# EasyEDA Pro project 学期项目.epro, schematic Sheet1
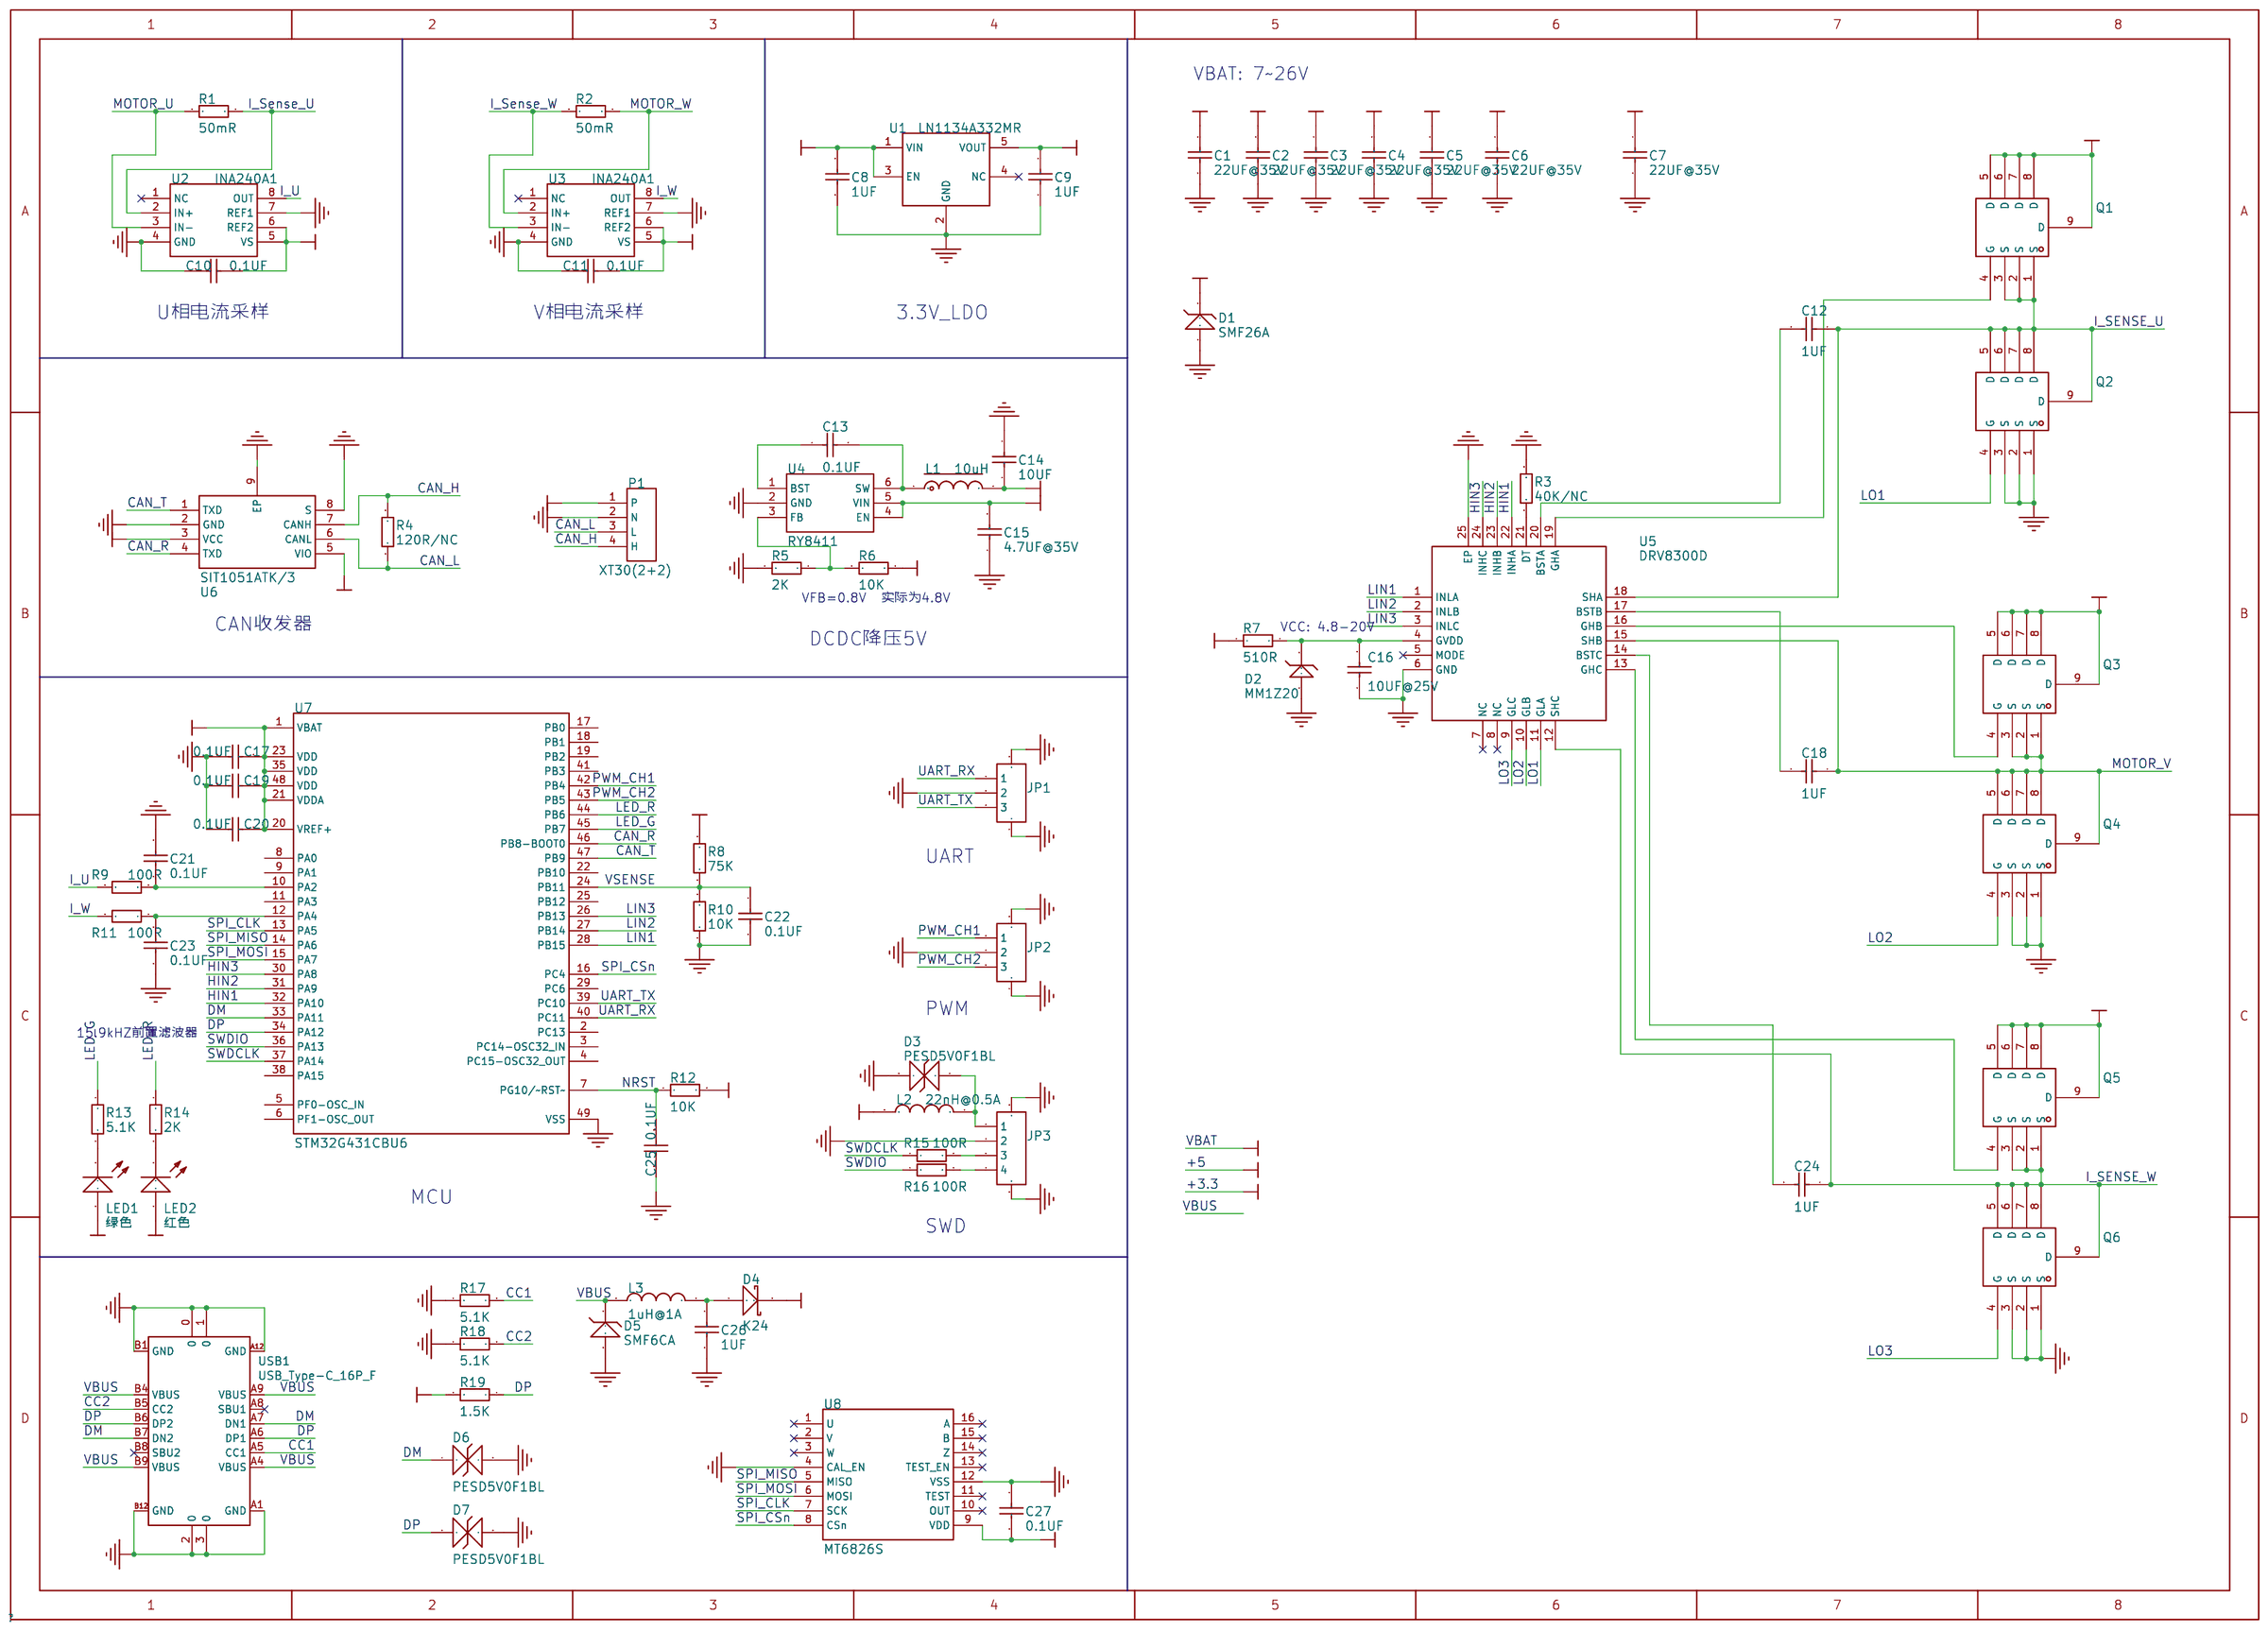
[diagram p5: schematic sheet]

## Parts
C1  22UF@35V  [C1206_NS]
C2  22UF@35V  [C1206_NS]
C3  22UF@35V  [C1206_NS]
C4  22UF@35V  [C1206_NS]
C5  22UF@35V  [C1206_NS]
C6  22UF@35V  [C1206_NS]
C7  22UF@35V  [C1206_NS]
C8  1UF  [C0402_NS]
C9  1UF  [C0402_NS]
C10  0.1UF  [C0402_NS]
C11  0.1UF  [C0402_NS]
C12  1UF  [C0603_NS]
C13  0.1UF  [C0402_NS]
C14  10UF  [C0805_NS]
C15  4.7UF@35V  [C0805_NS]
C16  10UF@25V  [C0603_NS]
C17  0.1UF  [C0402_NS]
C18  1UF  [C0603_NS]
C19  0.1UF  [C0402_NS]
C20  0.1UF  [C0402_NS]
C21  0.1UF  [C0402_NS]
C22  0.1UF  [C0402_NS]
C23  0.1UF  [C0402_NS]
C24  1UF  [C0603_NS]
C25  0.1UF  [C0402_NS]
C26  1UF  [C0603_NS]
C27  0.1UF  [C0402_NS]
D1  SMF26A  [SOD-123]
D2  MM1Z20  [SOD-123]
D3  PESD5V0F1BL  [DFN1006-2L_L1.0_W0.6_P0.7]
D4  K24  [SOD-123]
D5  SMF6CA  [SOD-123]
D6  PESD5V0F1BL  [DFN1006-2L_L1.0_W0.6_P0.7]
D7  PESD5V0F1BL  [DFN1006-2L_L1.0_W0.6_P0.7]
JP1  CON-3P  [SH1.0-WT-3P]
JP2  CON-3P  [SH1.0-WT-3P]
JP3  CON-4P  [HC0.8-WT-4P]
L1  10uH  [NR3015]
L2  22nH@0.5A  [L0402_NS]
L3  1uH@1A  [L1206_NS]
LED1  绿色  [LED0402_NS]
LED2  红色  [LED0402_NS]
P1  XT30(2+2)  [XT30(2+2)PW-M]
Q1  AON7544  [DFN8_L3.3_W3.3_P0.65]
Q2  AON7544  [DFN8_L3.3_W3.3_P0.65]
Q3  AON7544  [DFN8_L3.3_W3.3_P0.65]
Q4  AON7544  [DFN8_L3.3_W3.3_P0.65]
Q5  AON7544  [DFN8_L3.3_W3.3_P0.65]
Q6  AON7544  [DFN8_L3.3_W3.3_P0.65]
R1  50mR  [R1206_NS]
R2  50mR  [R1206_NS]
R3  40K/NC  [R0402_NS]
R4  120R/NC  [R0603_NS]
R5  2K  [R0402_NS]
R6  10K  [R0402_NS]
R7  510R  [R0603_NS]
R8  75K  [R0402_NS]
R9  100R  [R0402_NS]
R10  10K  [R0402_NS]
R11  100R  [R0402_NS]
R12  10K  [R0402_NS]
R13  5.1K  [R0402_NS]
R14  2K  [R0402_NS]
R15  100R  [R0402_NS]
R16  100R  [R0402_NS]
R17  5.1K  [R0402_NS]
R18  5.1K  [R0402_NS]
R19  1.5K  [R0402_NS]
U1  LN1134A332MR  [SOT23-5_L3.0_W1.7_P0.95]
U2  INA240A1  [TSSOP8_L4.4_W3.0_P0.65]
U3  INA240A1  [TSSOP8_L4.4_W3.0_P0.65]
U4  RY8411  [SOT23-6_L3.0_W1.7_P0.95]
U5  DRV8300D  [QFN24_L4.0_W4.0_P0.5]
U6  SIT1051ATK/3  [DFN8_L3.0_W3.0_P0.65]
U7  STM32G431CBU6  [QFN48_L7.0_W7.0_P0.5]
U8  MT6826S  [TSSOP16_L5.0_W4.4_P0.65]
USB1  USB_Type-C_16P_F  [USB_Type-C_SMD_16P_F]

## Library data of the parts
C1-C7 = 22UF@35V: 贴片电容/MLCC电容; BOM名称: MLCC; OriginFootprint 2: C0402_L; OriginFootprint 3: C0603_L; OriginFootprint 4: C0805_L; OriginFootprint 5: C1206_L; OriginFootprint 6: C1210_L; OriginFootprint 7: C1808_L; OriginFootprint 8: C1825_L; OriginFootprint 9: C2225_L; OriginFootprint 10: C0201_M; OriginFootprint 11: C0402_M; OriginFootprint 12: C0603_M; OriginFootprint 13: C0805_M; OriginFootprint 14: C1206_M; OriginFootprint 15: C1210_M; OriginFootprint 16: C1808_M; OriginFootprint 17: C1825_M; OriginFootprint 18: C2225_M; OriginFootprint 19: C0201_NS; OriginFootprint 20: C0402_NS; OriginFootprint 21: C01005_NS; OriginFootprint 22: C0805_NS; OriginFootprint 23: C1210_NS; OriginFootprint 24: C0603_NS; DesignItemID: C; LibraryName: 阻容
C8 C9 = 1UF_1: 贴片电容/MLCC电容; BOM名称: MLCC; OriginFootprint 2: C0402_L; OriginFootprint 3: C0603_L; OriginFootprint 4: C0805_L; OriginFootprint 5: C1206_L; OriginFootprint 6: C1210_L; OriginFootprint 7: C1808_L; OriginFootprint 8: C1825_L; OriginFootprint 9: C2225_L; OriginFootprint 10: C0201_M; OriginFootprint 11: C0402_M; OriginFootprint 12: C0603_M; OriginFootprint 13: C0805_M; OriginFootprint 14: C1206_M; OriginFootprint 15: C1210_M; OriginFootprint 16: C1808_M; OriginFootprint 17: C1825_M; OriginFootprint 18: C2225_M; OriginFootprint 19: C0201_NS; OriginFootprint 20: C01005_NS; OriginFootprint 21: C0805_NS; OriginFootprint 22: C1206_NS; OriginFootprint 23: C1210_NS; OriginFootprint 24: C0603_NS; DesignItemID: C; LibraryName: 阻容
C10 C11 C13 C17 C19-C23 C25 C27 = 0.1UF: 贴片电容/MLCC电容; BOM名称: MLCC; OriginFootprint 2: C0402_L; OriginFootprint 3: C0603_L; OriginFootprint 4: C0805_L; OriginFootprint 5: C1206_L; OriginFootprint 6: C1210_L; OriginFootprint 7: C1808_L; OriginFootprint 8: C1825_L; OriginFootprint 9: C2225_L; OriginFootprint 10: C0201_M; OriginFootprint 11: C0402_M; OriginFootprint 12: C0603_M; OriginFootprint 13: C0805_M; OriginFootprint 14: C1206_M; OriginFootprint 15: C1210_M; OriginFootprint 16: C1808_M; OriginFootprint 17: C1825_M; OriginFootprint 18: C2225_M; OriginFootprint 19: C0201_NS; OriginFootprint 20: C01005_NS; OriginFootprint 21: C0805_NS; OriginFootprint 22: C1206_NS; OriginFootprint 23: C1210_NS; OriginFootprint 24: C0603_NS; DesignItemID: C; LibraryName: 阻容
C12 C18 C24 C26 = 1UF: 贴片电容/MLCC电容; BOM名称: MLCC; OriginFootprint 2: C0402_L; OriginFootprint 3: C0603_L; OriginFootprint 4: C0805_L; OriginFootprint 5: C1206_L; OriginFootprint 6: C1210_L; OriginFootprint 7: C1808_L; OriginFootprint 8: C1825_L; OriginFootprint 9: C2225_L; OriginFootprint 10: C0201_M; OriginFootprint 11: C0402_M; OriginFootprint 12: C0603_M; OriginFootprint 13: C0805_M; OriginFootprint 14: C1206_M; OriginFootprint 15: C1210_M; OriginFootprint 16: C1808_M; OriginFootprint 17: C1825_M; OriginFootprint 18: C2225_M; OriginFootprint 19: C0201_NS; OriginFootprint 20: C0402_NS; OriginFootprint 21: C01005_NS; OriginFootprint 22: C0805_NS; OriginFootprint 23: C1206_NS; OriginFootprint 24: C1210_NS; DesignItemID: C; LibraryName: 阻容
C14 = 10UF: 贴片电容/MLCC电容; BOM名称: MLCC; OriginFootprint 2: C0402_L; OriginFootprint 3: C0603_L; OriginFootprint 4: C0805_L; OriginFootprint 5: C1206_L; OriginFootprint 6: C1210_L; OriginFootprint 7: C1808_L; OriginFootprint 8: C1825_L; OriginFootprint 9: C2225_L; OriginFootprint 10: C0201_M; OriginFootprint 11: C0402_M; OriginFootprint 12: C0603_M; OriginFootprint 13: C0805_M; OriginFootprint 14: C1206_M; OriginFootprint 15: C1210_M; OriginFootprint 16: C1808_M; OriginFootprint 17: C1825_M; OriginFootprint 18: C2225_M; OriginFootprint 19: C0201_NS; OriginFootprint 20: C0402_NS; OriginFootprint 21: C01005_NS; OriginFootprint 22: C1206_NS; OriginFootprint 23: C1210_NS; OriginFootprint 24: C0603_NS; DesignItemID: C; LibraryName: 阻容
C15 = 4.7UF@35V: 贴片电容/MLCC电容; BOM名称: MLCC; OriginFootprint 2: C0402_L; OriginFootprint 3: C0603_L; OriginFootprint 4: C0805_L; OriginFootprint 5: C1206_L; OriginFootprint 6: C1210_L; OriginFootprint 7: C1808_L; OriginFootprint 8: C1825_L; OriginFootprint 9: C2225_L; OriginFootprint 10: C0201_M; OriginFootprint 11: C0402_M; OriginFootprint 12: C0603_M; OriginFootprint 13: C0805_M; OriginFootprint 14: C1206_M; OriginFootprint 15: C1210_M; OriginFootprint 16: C1808_M; OriginFootprint 17: C1825_M; OriginFootprint 18: C2225_M; OriginFootprint 19: C0201_NS; OriginFootprint 20: C0402_NS; OriginFootprint 21: C01005_NS; OriginFootprint 22: C1206_NS; OriginFootprint 23: C1210_NS; OriginFootprint 24: C0603_NS; DesignItemID: C; LibraryName: 阻容
C16 = 10UF@25V: 贴片电容/MLCC电容; BOM名称: MLCC; OriginFootprint 2: C0402_L; OriginFootprint 3: C0603_L; OriginFootprint 4: C0805_L; OriginFootprint 5: C1206_L; OriginFootprint 6: C1210_L; OriginFootprint 7: C1808_L; OriginFootprint 8: C1825_L; OriginFootprint 9: C2225_L; OriginFootprint 10: C0201_M; OriginFootprint 11: C0402_M; OriginFootprint 12: C0603_M; OriginFootprint 13: C0805_M; OriginFootprint 14: C1206_M; OriginFootprint 15: C1210_M; OriginFootprint 16: C1808_M; OriginFootprint 17: C1825_M; OriginFootprint 18: C2225_M; OriginFootprint 19: C0201_NS; OriginFootprint 20: C0402_NS; OriginFootprint 21: C01005_NS; OriginFootprint 22: C0805_NS; OriginFootprint 23: C1206_NS; OriginFootprint 24: C1210_NS; DesignItemID: C; LibraryName: 阻容
D1 = SMF26A: TVS通用; BOM名称: TVS; OriginFootprint 2: SMB; OriginFootprint 3: SOD-123F; DesignItemID: TVS; LibraryName: 二极管(含LED)
D2 = MM1Z20: 稳压二极管; BOM名称: 稳压二极管; Power Dissipation (Pd): 500mW; Voltage: 5.1V; DesignItemID: MM1ZXX; LibraryName: 二极管(含LED)
D3 D6 D7 = PESD5V0F1BL: 双向静电和浪涌保护(TVS/ESD); LibraryName: 二极管(含LED)
D4 = K24: 肖特基二极管; BOM名称: 肖特基二极管; 属性: 个位*10V/十位A; OriginFootprint 2: SMB; OriginFootprint 3: SMC; OriginFootprint 4: SOD-323; OriginFootprint 5: SOD-523; DesignItemID: SSXX; LibraryName: 二极管(含LED)
D5 = SMF6CA: TVS通用; BOM名称: TVS; OriginFootprint 2: SMB; OriginFootprint 3: SOD-123F; DesignItemID: TVS; LibraryName: 二极管(含LED)
JP1 JP2 = CON-3P: 3P连接器; BOM名称: 3P连接器; DesignItemID: Header 3; LibraryName: 1.00mm连接器
JP3 = CON-4P: 4P连接器; BOM名称: 4P连接器; DesignItemID: Header 4; LibraryName: 0.80mm连接器
L1 = 10uH: 太诱-NR磁胶电感; BOM名称: NR磁胶电感; OriginFootprint 2: NR3010; OriginFootprint 3: NR3012; OriginFootprint 4: NR4010; OriginFootprint 5: NR4018; OriginFootprint 6: NR4020; OriginFootprint 7: NR4026; OriginFootprint 8: NR4030; OriginFootprint 9: NR5012; OriginFootprint 10: NR5020; OriginFootprint 11: NR5040; OriginFootprint 12: NR6020; OriginFootprint 13: NR6028; OriginFootprint 14: NR6045; OriginFootprint 15: NR8040; DesignItemID: L-NR; LibraryName: 电感
L2 = 22nH@0.5A: 小功率贴片电感; BOM名称: 小功率贴片电感; OriginFootprint 2: L0603; OriginFootprint 3: L0805; OriginFootprint 4: L1206; OriginFootprint 5: L1210; OriginFootprint 6: L1806; OriginFootprint 7: L1812; DesignItemID: L; LibraryName: 电感
L3 = 1uH@1A: 小功率贴片电感; BOM名称: 小功率贴片电感; OriginFootprint 2: L0603; OriginFootprint 3: L0805; OriginFootprint 4: L1206; OriginFootprint 5: L1210; OriginFootprint 6: L1806; OriginFootprint 7: L1812; OriginFootprint 8: L0402_NS; DesignItemID: L; LibraryName: 电感
LED1 = 绿色: 贴片LED; BOM名称: 贴片LED; OriginFootprint 2: LED0603_R; OriginFootprint 3: LED0603_B; OriginFootprint 4: LED0603_G; OriginFootprint 5: LED0603_Y; OriginFootprint 6: LED0805_G; OriginFootprint 7: LED0805_R; OriginFootprint 8: LED0805_B; OriginFootprint 9: LED0805_Y; OriginFootprint 10: LED 3528-2Pin; OriginFootprint 11: LED1206_G; OriginFootprint 12: LED 5730-V; OriginFootprint 13: LED1206_Y; OriginFootprint 14: LED0805_W; OriginFootprint 15: LED1206_B; OriginFootprint 16: LED1206_W; OriginFootprint 17: LED1206_R; OriginFootprint 18: LED0402_B; OriginFootprint 19: LED0402_G; OriginFootprint 20: LED0402_R; OriginFootprint 21: LED0402_W; OriginFootprint 22: LED0402_Y; DesignItemID: LED; LibraryName: 二极管(含LED)
LED2 = 红色: 贴片LED; BOM名称: 贴片LED; OriginFootprint 2: LED0603_R; OriginFootprint 3: LED0603_B; OriginFootprint 4: LED0603_G; OriginFootprint 5: LED0603_Y; OriginFootprint 6: LED0805_G; OriginFootprint 7: LED0805_R; OriginFootprint 8: LED0805_B; OriginFootprint 9: LED0805_Y; OriginFootprint 10: LED 3528-2Pin; OriginFootprint 11: LED1206_G; OriginFootprint 12: LED 5730-V; OriginFootprint 13: LED1206_Y; OriginFootprint 14: LED0805_W; OriginFootprint 15: LED1206_B; OriginFootprint 16: LED1206_W; OriginFootprint 17: LED1206_R; OriginFootprint 18: LED0402_B; OriginFootprint 19: LED0402_G; OriginFootprint 20: LED0402_R; OriginFootprint 21: LED0402_W; OriginFootprint 22: LED0402_Y; DesignItemID: LED; LibraryName: 二极管(含LED)
P1 = XT30(2+2): XT30(2+2)连接器; LibraryName: 接口
Q1-Q6 = AON7544: 类型:N沟道;漏源电压(Vdss):30V;连续漏极电流(Id):50A;导通电阻(RDS(on)Vgs,Id):5.7mΩ@10V,35A;阈值电压(Vgs(th)@Id):2.5V@250uA;; LCSC Part Name: N沟道 30V 50A; Supplier Footprint: DFN 3.3x3.3-8; Type: N沟道; Drain Source Voltage (Vdss): 30V; Continuous Drain Current (Id): 50A; Power Dissipation (Pd): 45W; Drain Source On Resistance (RDS(on)@Vgs,Id): 5.7mΩ@10V,35A; Gate Threshold Voltage (Vgs(th)@Id): 2.5V@250uA; DesignItemID: WSD3066DN33; LibraryName: 三极管-MOS管
R1 R2 = 50mR: 贴片电阻; BOM名称: 贴片电阻; OriginFootprint 2: R0402_L; OriginFootprint 3: R0603_L; OriginFootprint 4: R0805_L; OriginFootprint 5: R1206_L; OriginFootprint 6: R1210_L; OriginFootprint 7: R1812_L; OriginFootprint 8: R2010_L; OriginFootprint 9: R2512_L; OriginFootprint 10: R0201_M; OriginFootprint 11: R0402_M; OriginFootprint 12: R0603_M; OriginFootprint 13: R0805_M; OriginFootprint 14: R1206_M; OriginFootprint 15: R1210_M; OriginFootprint 16: R1812_M; OriginFootprint 17: R2010_M; OriginFootprint 18: R2512_M; OriginFootprint 19: R0201_NS; OriginFootprint 20: R0402_NS; OriginFootprint 21: R01005_NS; OriginFootprint 22: R0603_NS; OriginFootprint 23: R0805_NS; OriginFootprint 24: R1210_NS; DesignItemID: R; LibraryName: 阻容
R3 = 40K/NC: 贴片电阻; BOM名称: 贴片电阻; OriginFootprint 2: R0402_L; OriginFootprint 3: R0603_L; OriginFootprint 4: R0805_L; OriginFootprint 5: R1206_L; OriginFootprint 6: R1210_L; OriginFootprint 7: R1812_L; OriginFootprint 8: R2010_L; OriginFootprint 9: R2512_L; OriginFootprint 10: R0201_M; OriginFootprint 11: R0402_M; OriginFootprint 12: R0603_M; OriginFootprint 13: R0805_M; OriginFootprint 14: R1206_M; OriginFootprint 15: R1210_M; OriginFootprint 16: R1812_M; OriginFootprint 17: R2010_M; OriginFootprint 18: R2512_M; OriginFootprint 19: R0201_NS; OriginFootprint 20: R01005_NS; OriginFootprint 21: R0603_NS; OriginFootprint 22: R0805_NS; OriginFootprint 23: R1206_NS; OriginFootprint 24: R1210_NS; OriginFootprint 25: R2512_NS; DesignItemID: R; LibraryName: 阻容
R4 = 120R/NC: 贴片电阻; BOM名称: 贴片电阻; OriginFootprint 2: R0402_L; OriginFootprint 3: R0603_L; OriginFootprint 4: R0805_L; OriginFootprint 5: R1206_L; OriginFootprint 6: R1210_L; OriginFootprint 7: R1812_L; OriginFootprint 8: R2010_L; OriginFootprint 9: R2512_L; OriginFootprint 10: R0201_M; OriginFootprint 11: R0402_M; OriginFootprint 12: R0603_M; OriginFootprint 13: R0805_M; OriginFootprint 14: R1206_M; OriginFootprint 15: R1210_M; OriginFootprint 16: R1812_M; OriginFootprint 17: R2010_M; OriginFootprint 18: R2512_M; OriginFootprint 19: R0201_NS; OriginFootprint 20: R0402_NS; OriginFootprint 21: R01005_NS; OriginFootprint 22: R0805_NS; OriginFootprint 23: R1206_NS; OriginFootprint 24: R1210_NS; DesignItemID: R; LibraryName: 阻容
R5 R14 = 2K: 贴片电阻; BOM名称: 贴片电阻; OriginFootprint 2: R0402_L; OriginFootprint 3: R0603_L; OriginFootprint 4: R0805_L; OriginFootprint 5: R1206_L; OriginFootprint 6: R1210_L; OriginFootprint 7: R1812_L; OriginFootprint 8: R2010_L; OriginFootprint 9: R2512_L; OriginFootprint 10: R0201_M; OriginFootprint 11: R0402_M; OriginFootprint 12: R0603_M; OriginFootprint 13: R0805_M; OriginFootprint 14: R1206_M; OriginFootprint 15: R1210_M; OriginFootprint 16: R1812_M; OriginFootprint 17: R2010_M; OriginFootprint 18: R2512_M; OriginFootprint 19: R0201_NS; OriginFootprint 20: R01005_NS; OriginFootprint 21: R0603_NS; OriginFootprint 22: R0805_NS; OriginFootprint 23: R1206_NS; OriginFootprint 24: R1210_NS; DesignItemID: R; LibraryName: 阻容
R6 R12 = 10K: 贴片电阻; BOM名称: 贴片电阻; OriginFootprint 2: R0402_L; OriginFootprint 3: R0603_L; OriginFootprint 4: R0805_L; OriginFootprint 5: R1206_L; OriginFootprint 6: R1210_L; OriginFootprint 7: R1812_L; OriginFootprint 8: R2010_L; OriginFootprint 9: R2512_L; OriginFootprint 10: R0201_M; OriginFootprint 11: R0402_M; OriginFootprint 12: R0603_M; OriginFootprint 13: R0805_M; OriginFootprint 14: R1206_M; OriginFootprint 15: R1210_M; OriginFootprint 16: R1812_M; OriginFootprint 17: R2010_M; OriginFootprint 18: R2512_M; OriginFootprint 19: R0201_NS; OriginFootprint 20: R01005_NS; OriginFootprint 21: R0603_NS; OriginFootprint 22: R0805_NS; OriginFootprint 23: R1206_NS; OriginFootprint 24: R1210_NS; DesignItemID: R; LibraryName: 阻容
R7 = 510R: 贴片电阻; BOM名称: 贴片电阻; OriginFootprint 2: R0402_L; OriginFootprint 3: R0603_L; OriginFootprint 4: R0805_L; OriginFootprint 5: R1206_L; OriginFootprint 6: R1210_L; OriginFootprint 7: R1812_L; OriginFootprint 8: R2010_L; OriginFootprint 9: R2512_L; OriginFootprint 10: R0201_M; OriginFootprint 11: R0402_M; OriginFootprint 12: R0603_M; OriginFootprint 13: R0805_M; OriginFootprint 14: R1206_M; OriginFootprint 15: R1210_M; OriginFootprint 16: R1812_M; OriginFootprint 17: R2010_M; OriginFootprint 18: R2512_M; OriginFootprint 19: R0201_NS; OriginFootprint 20: R0402_NS; OriginFootprint 21: R01005_NS; OriginFootprint 22: R0805_NS; OriginFootprint 23: R1206_NS; OriginFootprint 24: R1210_NS; OriginFootprint 25: R2512_NS; DesignItemID: R; LibraryName: 阻容
R8 = 75K: 贴片电阻; BOM名称: 贴片电阻; OriginFootprint 2: R0402_L; OriginFootprint 3: R0603_L; OriginFootprint 4: R0805_L; OriginFootprint 5: R1206_L; OriginFootprint 6: R1210_L; OriginFootprint 7: R1812_L; OriginFootprint 8: R2010_L; OriginFootprint 9: R2512_L; OriginFootprint 10: R0201_M; OriginFootprint 11: R0402_M; OriginFootprint 12: R0603_M; OriginFootprint 13: R0805_M; OriginFootprint 14: R1206_M; OriginFootprint 15: R1210_M; OriginFootprint 16: R1812_M; OriginFootprint 17: R2010_M; OriginFootprint 18: R2512_M; OriginFootprint 19: R0201_NS; OriginFootprint 20: R01005_NS; OriginFootprint 21: R0603_NS; OriginFootprint 22: R0805_NS; OriginFootprint 23: R1206_NS; OriginFootprint 24: R1210_NS; OriginFootprint 25: R2512_NS; DesignItemID: R; LibraryName: 阻容
R9 R11 R15 R16 = 100R: 贴片电阻; BOM名称: 贴片电阻; OriginFootprint 2: R0402_L; OriginFootprint 3: R0603_L; OriginFootprint 4: R0805_L; OriginFootprint 5: R1206_L; OriginFootprint 6: R1210_L; OriginFootprint 7: R1812_L; OriginFootprint 8: R2010_L; OriginFootprint 9: R2512_L; OriginFootprint 10: R0201_M; OriginFootprint 11: R0402_M; OriginFootprint 12: R0603_M; OriginFootprint 13: R0805_M; OriginFootprint 14: R1206_M; OriginFootprint 15: R1210_M; OriginFootprint 16: R1812_M; OriginFootprint 17: R2010_M; OriginFootprint 18: R2512_M; OriginFootprint 19: R0201_NS; OriginFootprint 20: R01005_NS; OriginFootprint 21: R0603_NS; OriginFootprint 22: R0805_NS; OriginFootprint 23: R1206_NS; OriginFootprint 24: R1210_NS; OriginFootprint 25: R2512_NS; DesignItemID: R; LibraryName: 阻容
R10 = 10K_1: 贴片电阻; BOM名称: 贴片电阻; OriginFootprint 2: R0402_L; OriginFootprint 3: R0603_L; OriginFootprint 4: R0805_L; OriginFootprint 5: R1206_L; OriginFootprint 6: R1210_L; OriginFootprint 7: R1812_L; OriginFootprint 8: R2010_L; OriginFootprint 9: R2512_L; OriginFootprint 10: R0201_M; OriginFootprint 11: R0402_M; OriginFootprint 12: R0603_M; OriginFootprint 13: R0805_M; OriginFootprint 14: R1206_M; OriginFootprint 15: R1210_M; OriginFootprint 16: R1812_M; OriginFootprint 17: R2010_M; OriginFootprint 18: R2512_M; OriginFootprint 19: R0201_NS; OriginFootprint 20: R01005_NS; OriginFootprint 21: R0603_NS; OriginFootprint 22: R0805_NS; OriginFootprint 23: R1206_NS; OriginFootprint 24: R1210_NS; OriginFootprint 25: R2512_NS; DesignItemID: R; LibraryName: 阻容
R13 = 5.1K: 贴片电阻; BOM名称: 贴片电阻; OriginFootprint 2: R0402_L; OriginFootprint 3: R0603_L; OriginFootprint 4: R0805_L; OriginFootprint 5: R1206_L; OriginFootprint 6: R1210_L; OriginFootprint 7: R1812_L; OriginFootprint 8: R2010_L; OriginFootprint 9: R2512_L; OriginFootprint 10: R0201_M; OriginFootprint 11: R0402_M; OriginFootprint 12: R0603_M; OriginFootprint 13: R0805_M; OriginFootprint 14: R1206_M; OriginFootprint 15: R1210_M; OriginFootprint 16: R1812_M; OriginFootprint 17: R2010_M; OriginFootprint 18: R2512_M; OriginFootprint 19: R0201_NS; OriginFootprint 20: R01005_NS; OriginFootprint 21: R0603_NS; OriginFootprint 22: R0805_NS; OriginFootprint 23: R1206_NS; OriginFootprint 24: R1210_NS; DesignItemID: R; LibraryName: 阻容
R17 R18 = 5.1K_1: 贴片电阻; BOM名称: 贴片电阻; OriginFootprint 2: R0402_L; OriginFootprint 3: R0603_L; OriginFootprint 4: R0805_L; OriginFootprint 5: R1206_L; OriginFootprint 6: R1210_L; OriginFootprint 7: R1812_L; OriginFootprint 8: R2010_L; OriginFootprint 9: R2512_L; OriginFootprint 10: R0201_M; OriginFootprint 11: R0402_M; OriginFootprint 12: R0603_M; OriginFootprint 13: R0805_M; OriginFootprint 14: R1206_M; OriginFootprint 15: R1210_M; OriginFootprint 16: R1812_M; OriginFootprint 17: R2010_M; OriginFootprint 18: R2512_M; OriginFootprint 19: R0201_NS; OriginFootprint 20: R01005_NS; OriginFootprint 21: R0603_NS; OriginFootprint 22: R0805_NS; OriginFootprint 23: R1206_NS; OriginFootprint 24: R1210_NS; OriginFootprint 25: R2512_NS; DesignItemID: R; LibraryName: 阻容
R19 = 1.5K: 贴片电阻; BOM名称: 贴片电阻; OriginFootprint 2: R0402_L; OriginFootprint 3: R0603_L; OriginFootprint 4: R0805_L; OriginFootprint 5: R1206_L; OriginFootprint 6: R1210_L; OriginFootprint 7: R1812_L; OriginFootprint 8: R2010_L; OriginFootprint 9: R2512_L; OriginFootprint 10: R0201_M; OriginFootprint 11: R0402_M; OriginFootprint 12: R0603_M; OriginFootprint 13: R0805_M; OriginFootprint 14: R1206_M; OriginFootprint 15: R1210_M; OriginFootprint 16: R1812_M; OriginFootprint 17: R2010_M; OriginFootprint 18: R2512_M; OriginFootprint 19: R0201_NS; OriginFootprint 20: R01005_NS; OriginFootprint 21: R0603_NS; OriginFootprint 22: R0805_NS; OriginFootprint 23: R1206_NS; OriginFootprint 24: R1210_NS; OriginFootprint 25: R2512_NS; DesignItemID: R; LibraryName: 阻容
U1 = LN1134A332MR: DesignItemID: RT9013-33GB; LibraryName: LDO
U2 U3 = INA240A1: 具有增强的 PWM 抑制能力的 -4V 至 80V、双向、超精密电流感应放大器; DesignItemID: INA240; LibraryName: 运放
U4 = RY8411: 40V/1A/1.1MHz同步降压转换器; DesignItemID: JW5026; LibraryName: 电源IC
U5 = DRV8300D: 具有自举二极管的最大 100V 简单三相栅极驱动器; LibraryName: 电机驱动IC
U6 = SIT1051ATK/3: 5V 供电， IO 口兼容 3.3V，± 70V 总线耐压， CAN FD 静音模式总线收发器; Type: Transceiver; Protocol: CAN; Duplex: Half; Data Rate: 5Mbps; LibraryName: 协议芯片
U7 = STM32G431CBU6: Microcontroller 32-Bit ARM Cortex-M4 RISC 128KB Flash 1.71V to 3.6V QFN48; Temperature Range Low: -40°C; Number Of Adc Channels: 17; Lead Free: Yes; Number Of I/Os: 38; Device Class L3: Microcontrollers; Standoff Height: 0.05mm; Number Of Usb Channels: 1; Number Of Cores: 1; Temperature Range High: +85°C; Data Bus Width: 32bits; Number Of I2C Channels: 3; Height: 1.6mm; Digikey Description: MAINSTREAM ARM CORTEX-M4+ MCU 17; Device Class L1: Integrated Circuits (ICs); Manufacturer: STMicroelectronics; Number Of Pwm Channels: 31; Frequency: 170MHz; Package: LQFP48; RoHS: TRUE; Number Of A/D Converters: 1; Core Architecture: Arm Cortex-M4; Memory Type: FLASH; Device Class L2: Embedded Processors and Controllers; ComponentLink2Description: Datasheet; Number Of Timers/Counters: 14; Ram Size: 32KBytes; Max Junction Temp: +105°C; Temperature: -40°C to +85°C; Ambient Temperature Range High: +85°C; Ambient Temperature Range Low: -40°C; Memory Size: 128KBytes; Min Supply Voltage: 1.62V; Octopart: https://octopart.com/stm32g431cbt6-stmicroelectronics-98835224; Max Supply Voltage: 3.6V; ComponentLink2URL: https://www.st.com/resource/en/datasheet/stm32g431cb.pdf; Automotive: No; Number Of Spi Channels: 3; Number Of Uart Channels: 4; Manufacturer Part Number: STM32G431CBT6; Interface: I2C,SPI,UART,USART,CAN,USB,LIN,IrDA,I2S; Category: IC; LibraryName: 2.1 - STM32 G0及G4系列单片机
U8 = MT6826S: 15位高分辨率、高速磁性角度编码器IC; LibraryName: 其他
USB1 = USB_Type-C_16P_F: USB_Type-C母座; BOM名称: USB_Type-C母座; LibraryName: 接口

## Nets
GND: C1.2 C2.2 C3.2 C4.2 C5.2 C6.2 C7.2 C8.1 C9.1 C10.1 C11.1 C14.1 C15.1 C16.1 C17.2 C19.2 C20.2 C21.1 C22.2 C23.2 C25.1 C26.1 C27.1 D1.1(A) D2.1(A) D3.2(K) D5.1(A) D6.2(K) D7.2(K) JP1.0 JP1.2 JP1.4(0) JP2.0 JP2.2 JP2.4(0) JP3.0 JP3.2 JP3.5(0) P1.2(N) Q2.1(S) Q2.2(S) Q2.3(S) Q4.1(S) Q4.2(S) Q4.3(S) Q6.1(S) Q6.2(S) Q6.3(S) R3.2 R5.2 R10.1 R17.1 R18.1 U1.2(GND) U2.4(GND) U2.7(REF1) U3.4(GND) U3.7(REF1) U4.2(GND) U5.6(GND) U5.25(EP) U6.2(GND) U6.8(S) U6.9(EP) U7.49(VSS) U8.4(CAL_EN) U8.12(VSS) USB1.0 USB1.1(0) USB1.2(0) USB1.3(0) USB1.A1(GND) USB1.A12(GND) USB1.B1(GND) USB1.B12(GND)
VBAT: C1.1 C2.1 C3.1 C4.1 C5.1 C6.1 C7.1 C15.2 D1.2(K) P1.1(P) Q1.5(D) Q1.6(D) Q1.7(D) Q1.8(D) Q1.9(D) Q3.5(D) Q3.6(D) Q3.7(D) Q3.8(D) Q3.9(D) Q5.5(D) Q5.6(D) Q5.7(D) Q5.8(D) Q5.9(D) R7.1 R8.2 U4.4(EN) U4.5(VIN)
VBUS: D5.2(K) L3.1 USB1.A4(VBUS) USB1.A9(VBUS) USB1.B4(VBUS) USB1.B9(VBUS)
+3.3: C9.2 C10.2 C11.2 C17.1 C19.1 C20.1 C27.2 L2.1 LED1.1(A) LED2.1(A) R12.2 R19.2 U1.5(VOUT) U2.5(VS) U2.6(REF2) U3.5(VS) U3.6(REF2) U6.5(VIO) U7.1(VBAT) U7.20(VREF+) U7.21(VDDA) U7.23(VDD) U7.35(VDD) U7.48(VDD) U8.9(VDD)
+5: C8.2 C14.2 D4.2(K) L1.2 R6.1 U1.1(VIN) U1.3(EN) U6.3(VCC)
CAN_H: P1.4(H) R4.2 U6.7(CANH)
CAN_L: P1.3(L) R4.1 U6.6(CANL)
CAN_R: U6.4(TXD) U7.46(PB8-BOOT0)
CAN_T: U6.1(TXD) U7.47(PB9)
CC1: R17.2 USB1.A5(CC1)
CC2: R18.2 USB1.B5(CC2)
DM: D6.1(A) U7.33(PA11) USB1.A7(DN1) USB1.B7(DN2)
DP: D7.1(A) R19.1 U7.34(PA12) USB1.A6(DP1) USB1.B6(DP2)
HIN1: U5.22(INHA) U7.32(PA10)
HIN2: U5.23(INHB) U7.31(PA9)
HIN3: U5.24(INHC) U7.30(PA8)
I_SENSE_U: C12.1 Q1.1(S) Q1.2(S) Q1.3(S) Q2.5(D) Q2.6(D) Q2.7(D) Q2.8(D) Q2.9(D) U5.18(SHA)
I_Sense_U: R1.1 U2.2(IN+)
I_SENSE_W: C24.1 Q5.1(S) Q5.2(S) Q5.3(S) Q6.5(D) Q6.6(D) Q6.7(D) Q6.8(D) Q6.9(D) U5.12(SHC)
I_Sense_W: R2.2 U3.3(IN-)
I_U: R9.2 U2.8(OUT)
I_W: R11.2 U3.8(OUT)
LED_G: R13.1 U7.45(PB7)
LED_R: R14.1 U7.44(PB6)
LIN1: U5.1(INLA) U7.28(PB15)
LIN2: U5.2(INLB) U7.27(PB14)
LIN3: U5.3(INLC) U7.26(PB13)
LO1: Q2.4(G) U5.11(GLA)
LO2: Q4.4(G) U5.10(GLB)
LO3: Q6.4(G) U5.9(GLC)
MOTOR_U: R1.2 U2.3(IN-)
MOTOR_V: C18.1 Q3.1(S) Q3.2(S) Q3.3(S) Q4.5(D) Q4.6(D) Q4.7(D) Q4.8(D) Q4.9(D) U5.15(SHB)
MOTOR_W: R2.1 U3.2(IN+)
NRST: C25.2 R12.1 U7.7(PG10/~RST~)
PWM_CH1: JP2.1 U7.42(PB4)
PWM_CH2: JP2.3 U7.43(PB5)
SPI_CLK: U7.13(PA5) U8.7(SCK)
SPI_CSn: U7.16(PC4) U8.8(CSn)
SPI_MISO: U7.14(PA6) U8.5(MISO)
SPI_MOSI: U7.15(PA7) U8.6(MOSI)
SWDCLK: R15.1 U7.37(PA14)
SWDIO: R16.1 U7.36(PA13)
UART_RX: JP1.1 U7.40(PC11)
UART_TX: JP1.3 U7.39(PC10)
VSENSE: C22.1 R8.1 R10.2 U7.24(PB11)
$1N166: C12.2 U5.20(BSTA)
$1N167: C13.1 U4.1(BST)
$1N168: C13.2 L1.1 U4.6(SW)
$1N169: R5.1 R6.2 U4.3(FB)
$1N170: C18.2 U5.17(BSTB)
$1N171: C24.2 U5.14(BSTC)
$1N172: C16.2 D2.2(K) R7.2 U5.4(GVDD)
$1N173: C21.2 R9.1 U7.10(PA2)
$1N174: C23.1 R11.1 U7.12(PA4)
$1N175: D3.1(A) JP3.1 L2.2
$1N176: C26.2 D4.1(A) L3.2
$1N177: JP3.3 R15.2
$1N178: JP3.4 R16.2
$1N182: Q3.4(G) U5.16(GHB)
$1N187: R3.1 U5.21(DT)
$1N188: LED1.2(K) R13.2
$1N189: LED2.2(K) R14.2
Net-(Q1-4): Q1.4(G) U5.19(GHA)
Net-(Q5-4): Q5.4(G) U5.13(GHC)

Not connected (* = marked no-connect by the designer): U1 4(NC)*; U2 1(NC)*; U3 1(NC)*; U5 5(MODE)* 7(NC)* 8(NC)*; U7 2(PC13) 3(PC14-OSC32 IN) 4(PC15-OSC32 OUT) 5(PF0-OSC IN) 6(PF1-OSC OUT) 8(PA0) 9(PA1) 11(PA3) 17(PB0) 18(PB1) 19(PB2) 22(PB10) 25(PB12) 29(PC6) 38(PA15) 41(PB3); U8 1(U)* 2(V)* 3(W)* 10(OUT)* 11(TEST)* 13(TEST_EN)* 14(Z)* 15(B)* 16(A)*; USB1 A8(SBU1)* B8(SBU2)*

## Notes on the sheet
- VBAT: 7~26V
- U相电流采样
- V相电流采样
- 3.3V_LDO
- VFB=0.8V
- 实际为4.8V
- CAN收发器
- VCC: 4.8-20V
- DCDC降压5V
- UART
- PWM
- 15.9kHZ前置滤波器
- MCU
- SWD
